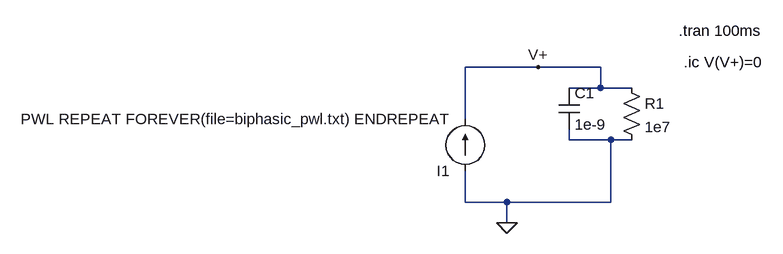
[diagram p0: schematic biphasic_triphasic_simple.asc]
biphasic_triphasic_simple.asc, the LTspice schematic file:
Version 4
SHEET 1 880 680
WIRE 112 64 0 64
WIRE 208 64 112 64
WIRE 208 96 208 64
WIRE 208 96 160 96
WIRE 256 96 208 96
WIRE 0 144 0 64
WIRE 160 176 160 160
WIRE 224 176 160 176
WIRE 256 176 224 176
WIRE 0 272 0 224
WIRE 64 272 0 272
WIRE 224 272 224 176
WIRE 224 272 64 272
WIRE 64 304 64 272
FLAG 112 64 V+
FLAG 64 304 0
SYMBOL cap 144 96 R0
SYMATTR InstName C1
SYMATTR Value 1e-9
SYMBOL res 240 80 R0
SYMATTR InstName R1
SYMATTR Value 1e7
SYMBOL current 0 224 R180
WINDOW 123 0 0 Left 2
WINDOW 39 0 0 Left 2
SYMATTR InstName I1
SYMATTR Value PWL REPEAT FOREVER(file=biphasic_pwl.txt) ENDREPEAT
TEXT 328 8 Left 2 !.tran 100ms
TEXT 336 56 Left 2 !.ic V(V+)=0

The netlist it stands for:
* biphasic_triphasic_simple.asc
C1 V+ 0 1e-9
R1 V+ 0 1e7
I1 0 V+ PWL REPEAT FOREVER(file=biphasic_pwl.txt) ENDREPEAT
.tran 100ms
.ic V(V+)=0
.backanno
.end